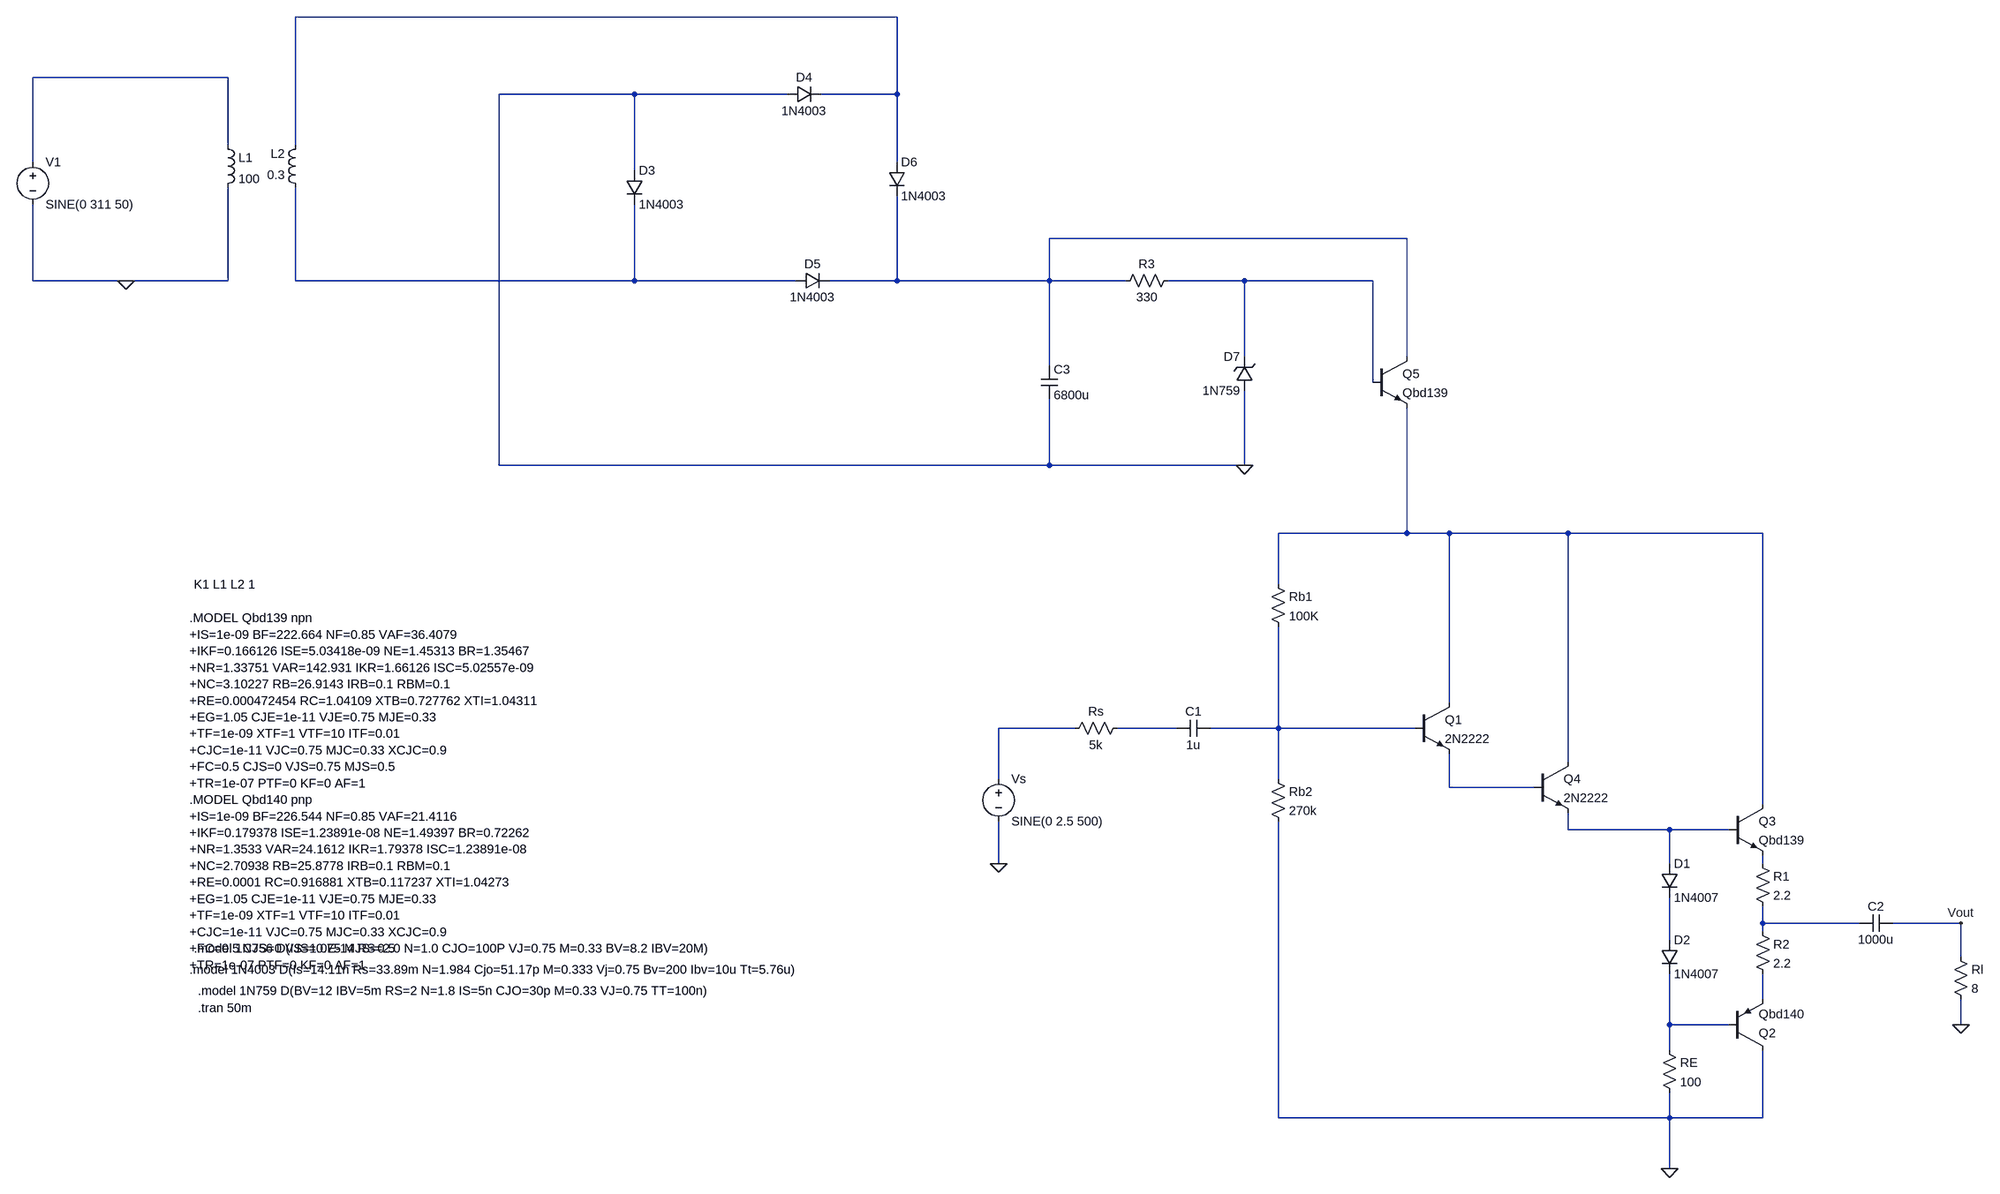
[diagram p0: schematic amplifier.asc]
amplifier.asc, the LTspice schematic file:
Version 4.1
SHEET 1 1876 1032
WIRE -400 -1600 -1712 -1600
WIRE -1840 -1456 -2208 -1456
WIRE -1072 -1424 -1328 -1424
WIRE -784 -1424 -1072 -1424
WIRE -400 -1424 -400 -1600
WIRE -400 -1424 -720 -1424
WIRE -1840 -1328 -1840 -1456
WIRE -1712 -1328 -1712 -1600
WIRE -2208 -1296 -2208 -1456
WIRE -400 -1296 -400 -1424
WIRE -1072 -1280 -1072 -1424
WIRE 576 -1152 -112 -1152
WIRE -2208 -1072 -2208 -1216
WIRE -2032 -1072 -2208 -1072
WIRE -1840 -1072 -1840 -1248
WIRE -1840 -1072 -2032 -1072
WIRE -1712 -1072 -1712 -1248
WIRE -1072 -1072 -1072 -1216
WIRE -1072 -1072 -1712 -1072
WIRE -768 -1072 -1072 -1072
WIRE -400 -1072 -400 -1232
WIRE -400 -1072 -704 -1072
WIRE -112 -1072 -112 -1152
WIRE -112 -1072 -400 -1072
WIRE 32 -1072 -112 -1072
WIRE 256 -1072 112 -1072
WIRE 512 -1072 256 -1072
WIRE 256 -928 256 -1072
WIRE 576 -928 576 -1152
WIRE -112 -912 -112 -1072
WIRE 512 -880 512 -1072
WIRE -1328 -688 -1328 -1424
WIRE -112 -688 -112 -848
WIRE -112 -688 -1328 -688
WIRE 256 -688 256 -864
WIRE 256 -688 -112 -688
WIRE 576 -448 576 -832
WIRE 576 -448 320 -448
WIRE 656 -448 576 -448
WIRE 880 -448 656 -448
WIRE 1248 -448 880 -448
WIRE 320 -352 320 -448
WIRE 656 -128 656 -448
WIRE -64 -80 -208 -80
WIRE 128 -80 16 -80
WIRE 320 -80 320 -272
WIRE 320 -80 192 -80
WIRE 592 -80 320 -80
WIRE 880 -16 880 -448
WIRE -208 16 -208 -80
WIRE 320 16 320 -80
WIRE 656 32 656 -32
WIRE 816 32 656 32
WIRE 1248 64 1248 -448
WIRE 880 112 880 80
WIRE 1072 112 880 112
WIRE 1184 112 1072 112
WIRE -208 176 -208 96
WIRE 1072 176 1072 112
WIRE 1248 176 1248 160
WIRE 1248 288 1248 256
WIRE 1440 288 1248 288
WIRE 1632 288 1504 288
WIRE 1248 304 1248 288
WIRE 1072 320 1072 240
WIRE 1632 352 1632 288
WIRE 1248 432 1248 384
WIRE 1072 480 1072 384
WIRE 1184 480 1072 480
WIRE 1632 480 1632 432
WIRE 1072 528 1072 480
WIRE 320 656 320 96
WIRE 1072 656 1072 608
WIRE 1072 656 320 656
WIRE 1248 656 1248 528
WIRE 1248 656 1072 656
WIRE 1072 752 1072 656
FLAG 1632 480 0
FLAG -208 176 0
FLAG 1632 288 Vout
FLAG 1072 752 0
FLAG -2032 -1072 0
FLAG 256 -688 0
SYMBOL voltage -208 0 R0
WINDOW 123 0 0 Left 0
WINDOW 39 0 0 Left 0
SYMATTR InstName Vs
SYMATTR Value SINE(0 2.5 500)
SYMBOL res 32 -96 R90
WINDOW 0 0 56 VBottom 2
WINDOW 3 32 56 VTop 2
SYMATTR InstName Rs
SYMATTR Value 5k
SYMBOL cap 192 -96 R90
WINDOW 0 0 32 VBottom 2
WINDOW 3 32 32 VTop 2
SYMATTR InstName C1
SYMATTR Value 1u
SYMBOL res 304 0 R0
SYMATTR InstName Rb2
SYMATTR Value 270k
SYMBOL pnp 1184 528 M180
SYMATTR InstName Q2
SYMATTR Value Qbd140
SYMBOL res 1056 512 R0
SYMATTR InstName RE
SYMATTR Value 100
SYMBOL npn 1184 64 R0
SYMATTR InstName Q3
SYMATTR Value Qbd139
SYMBOL diode 1056 176 R0
SYMATTR InstName D1
SYMATTR Value 1N4007
SYMBOL diode 1056 320 R0
SYMATTR InstName D2
SYMATTR Value 1N4007
SYMBOL cap 1504 272 R90
WINDOW 0 0 32 VBottom 2
WINDOW 3 32 32 VTop 2
SYMATTR InstName C2
SYMATTR Value 1000u
SYMBOL res 1616 336 R0
SYMATTR InstName Rl
SYMATTR Value 8
SYMBOL res 304 -368 R0
SYMATTR InstName Rb1
SYMATTR Value 100K
SYMBOL npn 592 -128 R0
SYMATTR InstName Q1
SYMATTR Value 2N2222
SYMBOL npn 816 -16 R0
SYMATTR InstName Q4
SYMATTR Value 2N2222
SYMBOL res 1232 160 R0
SYMATTR InstName R1
SYMATTR Value 2.2
SYMBOL res 1232 288 R0
SYMATTR InstName R2
SYMATTR Value 2.2
SYMBOL voltage -2208 -1312 R0
WINDOW 123 0 0 Left 0
WINDOW 39 0 0 Left 0
SYMATTR InstName V1
SYMATTR Value SINE(0 311 50)
SYMBOL ind -1856 -1344 R0
SYMATTR InstName L1
SYMATTR Value 100
SYMATTR Type ind
SYMATTR SpiceLine Rser=0.1
SYMBOL ind -1696 -1232 R180
WINDOW 0 36 80 Left 2
WINDOW 3 36 40 Left 2
SYMATTR InstName L2
SYMATTR Value 0.3
SYMATTR Type ind
SYMBOL npn 512 -928 R0
SYMATTR InstName Q5
SYMATTR Value Qbd139
SYMBOL zener 272 -864 R180
WINDOW 0 24 64 Left 2
WINDOW 3 24 0 Left 2
SYMATTR InstName D7
SYMATTR Value 1N759
SYMBOL cap -128 -912 R0
SYMATTR InstName C3
SYMATTR Value 6800u
SYMBOL res 128 -1088 R90
WINDOW 0 0 56 VBottom 2
WINDOW 3 32 56 VTop 2
SYMATTR InstName R3
SYMATTR Value 330
SYMBOL diode -1088 -1280 R0
SYMATTR InstName D3
SYMATTR Value 1N4003
SYMBOL diode -784 -1408 R270
WINDOW 0 32 32 VTop 2
WINDOW 3 0 32 VBottom 2
SYMATTR InstName D4
SYMATTR Value 1N4003
SYMBOL diode -768 -1056 R270
WINDOW 0 32 32 VTop 2
WINDOW 3 0 32 VBottom 2
SYMATTR InstName D5
SYMATTR Value 1N4003
SYMBOL diode -416 -1296 R0
SYMATTR InstName D6
SYMATTR Value 1N4003
TEXT -1896 448 Left 2 !.tran 50m
TEXT -1912 -288 Left 2 !.MODEL Qbd139 npn\n+IS=1e-09 BF=222.664 NF=0.85 VAF=36.4079\n+IKF=0.166126 ISE=5.03418e-09 NE=1.45313 BR=1.35467\n+NR=1.33751 VAR=142.931 IKR=1.66126 ISC=5.02557e-09\n+NC=3.10227 RB=26.9143 IRB=0.1 RBM=0.1\n+RE=0.000472454 RC=1.04109 XTB=0.727762 XTI=1.04311\n+EG=1.05 CJE=1e-11 VJE=0.75 MJE=0.33\n+TF=1e-09 XTF=1 VTF=10 ITF=0.01\n+CJC=1e-11 VJC=0.75 MJC=0.33 XCJC=0.9\n+FC=0.5 CJS=0 VJS=0.75 MJS=0.5\n+TR=1e-07 PTF=0 KF=0 AF=1\n.MODEL Qbd140 pnp\n+IS=1e-09 BF=226.544 NF=0.85 VAF=21.4116\n+IKF=0.179378 ISE=1.23891e-08 NE=1.49397 BR=0.72262\n+NR=1.3533 VAR=24.1612 IKR=1.79378 ISC=1.23891e-08\n+NC=2.70938 RB=25.8778 IRB=0.1 RBM=0.1\n+RE=0.0001 RC=0.916881 XTB=0.117237 XTI=1.04273\n+EG=1.05 CJE=1e-11 VJE=0.75 MJE=0.33\n+TF=1e-09 XTF=1 VTF=10 ITF=0.01\n+CJC=1e-11 VJC=0.75 MJC=0.33 XCJC=0.9\n+FC=0.5 CJS=0 VJS=0.75 MJS=0.5\n+TR=1e-07 PTF=0 KF=0 AF=1
TEXT -1904 -352 Left 2 !K1 L1 L2 1
TEXT -1904 336 Left 2 !.model 1N756 D(IS=1.0E-14 RS=2.0 N=1.0 CJO=100P VJ=0.75 M=0.33 BV=8.2 IBV=20M)
TEXT -1912 376 Left 2 !.model 1N4003 D(Is=14.11n Rs=33.89m N=1.984 Cjo=51.17p M=0.333 Vj=0.75 Bv=200 Ibv=10u Tt=5.76u)
TEXT -1896 416 Left 2 !.model 1N759 D(BV=12 IBV=5m RS=2 N=1.8 IS=5n CJO=30p M=0.33 VJ=0.75 TT=100n)

The netlist it stands for:
* amplifier.asc
Vs N007 0 SINE(0 2.5 500)
Rs N008 N007 5k
C1 N009 N008 1u
Rb2 N009 0 270k
Q2 0 N016 N015 0 Qbd140
RE N016 0 100
Q3 N006 N011 N012 0 Qbd139
D1 N011 N014 1N4007
D2 N014 N016 1N4007
C2 Vout N013 1000u
Rl Vout 0 8
Rb1 N006 N009 100K
Q1 N006 N009 N010 0 2N2222
Q4 N006 N010 N011 0 2N2222
R1 N012 N013 2.2
R2 N013 N015 2.2
V1 N002 0 SINE(0 311 50)
L1 N002 0 100 Rser=0.1
L2 N004 N001 0.3
Q5 N003 N005 N006 0 Qbd139
D7 0 N005 1N759
C3 N003 0 6800u
R3 N005 N003 330
D3 0 N004 1N4003
D4 0 N001 1N4003
D5 N004 N003 1N4003
D6 N001 N003 1N4003
.model D D
.lib standard.dio
.model NPN NPN
.model PNP PNP
.lib standard.bjt
.tran 50m
.MODEL Qbd139 npn
+IS=1e-09 BF=222.664 NF=0.85 VAF=36.4079
+IKF=0.166126 ISE=5.03418e-09 NE=1.45313 BR=1.35467
+NR=1.33751 VAR=142.931 IKR=1.66126 ISC=5.02557e-09
+NC=3.10227 RB=26.9143 IRB=0.1 RBM=0.1
+RE=0.000472454 RC=1.04109 XTB=0.727762 XTI=1.04311
+EG=1.05 CJE=1e-11 VJE=0.75 MJE=0.33
+TF=1e-09 XTF=1 VTF=10 ITF=0.01
+CJC=1e-11 VJC=0.75 MJC=0.33 XCJC=0.9
+FC=0.5 CJS=0 VJS=0.75 MJS=0.5
+TR=1e-07 PTF=0 KF=0 AF=1
.MODEL Qbd140 pnp
+IS=1e-09 BF=226.544 NF=0.85 VAF=21.4116
+IKF=0.179378 ISE=1.23891e-08 NE=1.49397 BR=0.72262
+NR=1.3533 VAR=24.1612 IKR=1.79378 ISC=1.23891e-08
+NC=2.70938 RB=25.8778 IRB=0.1 RBM=0.1
+RE=0.0001 RC=0.916881 XTB=0.117237 XTI=1.04273
+EG=1.05 CJE=1e-11 VJE=0.75 MJE=0.33
+TF=1e-09 XTF=1 VTF=10 ITF=0.01
+CJC=1e-11 VJC=0.75 MJC=0.33 XCJC=0.9
+FC=0.5 CJS=0 VJS=0.75 MJS=0.5
+TR=1e-07 PTF=0 KF=0 AF=1
K1 L1 L2 1
.model 1N756 D(IS=1.0E-14 RS=2.0 N=1.0 CJO=100P VJ=0.75 M=0.33 BV=8.2 IBV=20M)
.model 1N4003 D(Is=14.11n Rs=33.89m N=1.984 Cjo=51.17p M=0.333 Vj=0.75 Bv=200 Ibv=10u Tt=5.76u)
.model 1N759 D(BV=12 IBV=5m RS=2 N=1.8 IS=5n CJO=30p M=0.33 VJ=0.75 TT=100n)
.backanno
.end